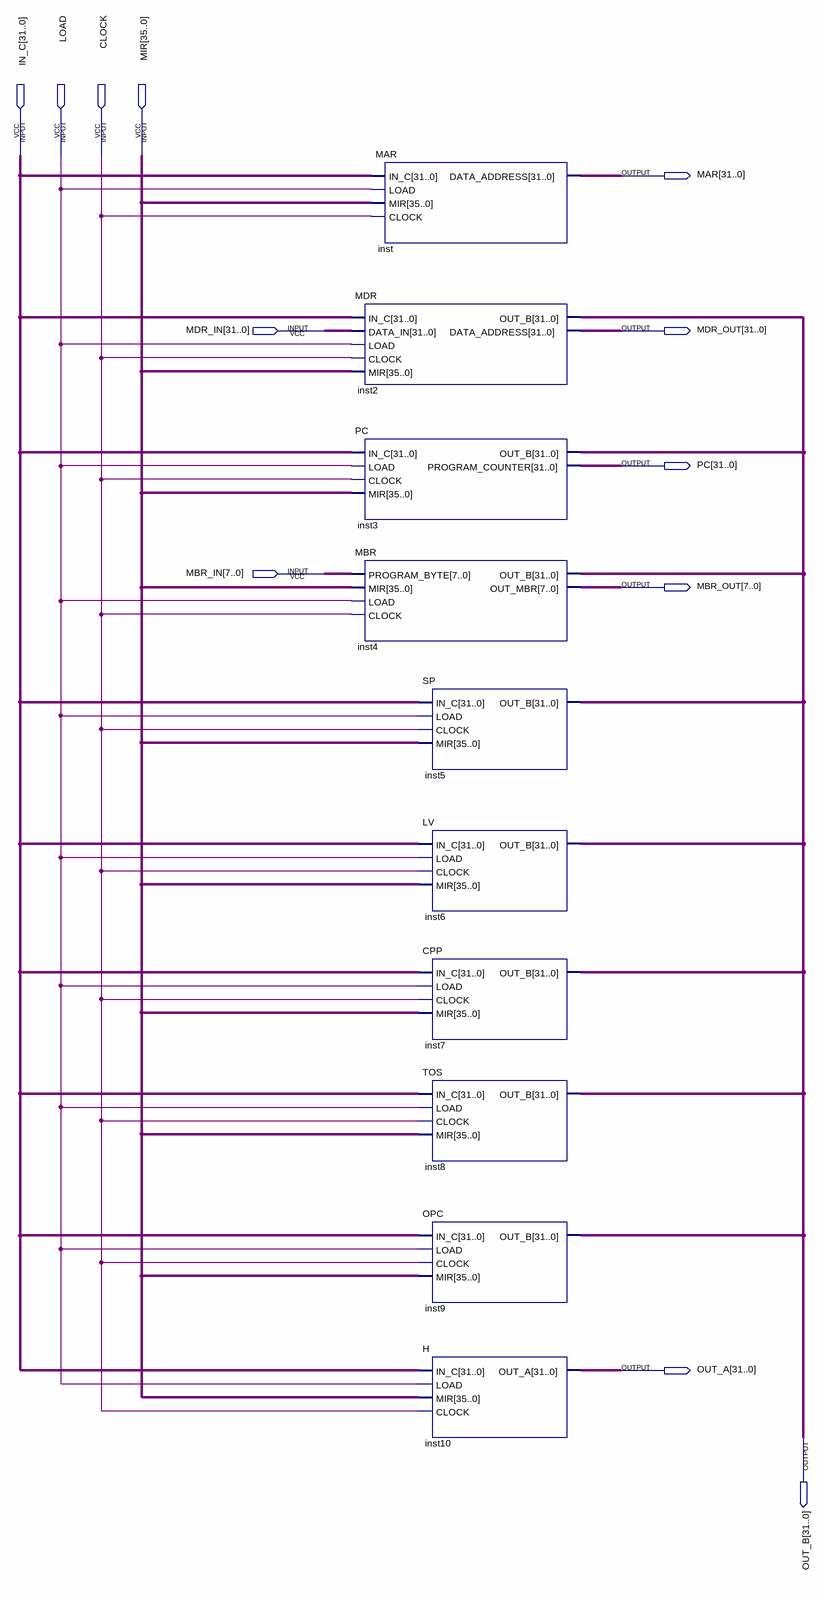
[diagram p0: schematic sheet]
// Quartus schematic BANK_REGS.bdf as structural Verilog: 10 symbols, 12 pins
module BANK_REGS (
  input  [31:0] IN_C,
  input  LOAD,
  input  CLOCK,
  input  [35:0] MIR,
  input  [31:0] MDR_IN,
  input  [7:0] MBR_IN,
  output [31:0] MAR,
  output [31:0] MDR_OUT,
  output [31:0] PC,
  output [7:0] MBR_OUT,
  output [31:0] OUT_A,
  output [31:0] OUT_B
);

  MDR inst2 (
    .IN_C(IN_C), .DATA_IN(MDR_IN), .LOAD(LOAD), .CLOCK(CLOCK), .MIR(MIR), .OUT_B(OUT_B),
    .DATA_ADDRESS(MDR_OUT));
  PC inst3 (.IN_C(IN_C), .LOAD(LOAD), .CLOCK(CLOCK), .MIR(MIR), .OUT_B(OUT_B), .PROGRAM_COUNTER(PC));
  MBR inst4 (.PROGRAM_BYTE(MBR_IN), .MIR(MIR), .LOAD(LOAD), .CLOCK(CLOCK), .OUT_B(OUT_B), .OUT_MBR(MBR_OUT));
  MAR inst (.IN_C(IN_C), .LOAD(LOAD), .MIR(MIR), .CLOCK(CLOCK), .DATA_ADDRESS(MAR));
  SP inst5 (.IN_C(IN_C), .LOAD(LOAD), .CLOCK(CLOCK), .MIR(MIR), .OUT_B(OUT_B));
  LV inst6 (.IN_C(IN_C), .LOAD(LOAD), .CLOCK(CLOCK), .MIR(MIR), .OUT_B(OUT_B));
  CPP inst7 (.IN_C(IN_C), .LOAD(LOAD), .CLOCK(CLOCK), .MIR(MIR), .OUT_B(OUT_B));
  TOS inst8 (.IN_C(IN_C), .LOAD(LOAD), .CLOCK(CLOCK), .MIR(MIR), .OUT_B(OUT_B));
  OPC inst9 (.IN_C(IN_C), .LOAD(LOAD), .CLOCK(CLOCK), .MIR(MIR), .OUT_B(OUT_B));
  H inst10 (.IN_C(IN_C), .LOAD(LOAD), .MIR(MIR), .CLOCK(CLOCK), .OUT_A(OUT_A));
endmodule
